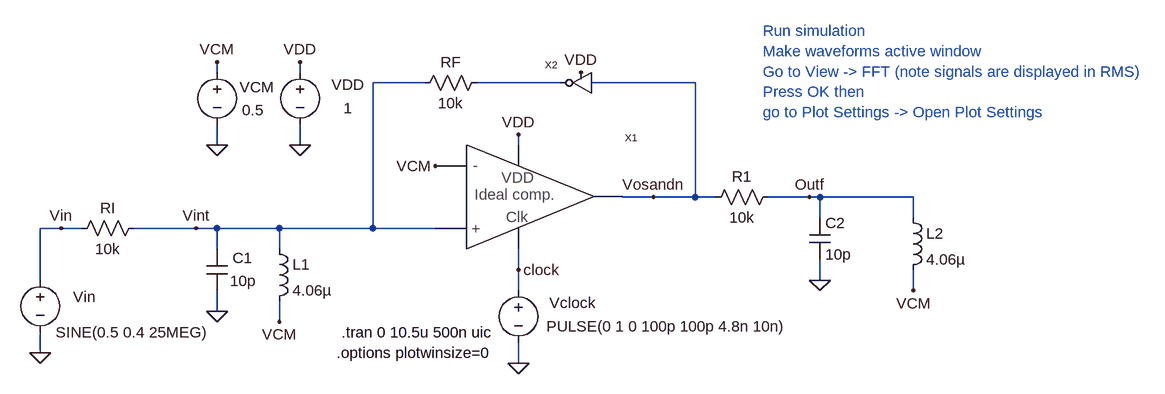
[diagram p0: schematic _Fig8_5_MSD.asc]
_Fig8_5_MSD.asc, the LTspice schematic file:
Version 4
SHEET 1 1132 680
WIRE -368 -80 -368 -96
WIRE -240 -80 -240 -96
WIRE -48 -64 -128 -64
WIRE 160 -64 32 -64
WIRE 368 -64 208 -64
WIRE -368 32 -368 0
WIRE -240 32 -240 0
WIRE 96 32 96 16
WIRE 304 112 256 112
WIRE 368 112 368 -64
WIRE 368 112 304 112
WIRE 400 112 368 112
WIRE 544 112 480 112
WIRE 560 112 544 112
WIRE 704 112 560 112
WIRE 560 144 560 112
WIRE 704 144 704 112
WIRE -608 160 -640 160
WIRE -576 160 -608 160
WIRE -400 160 -496 160
WIRE -368 160 -400 160
WIRE -272 160 -368 160
WIRE -128 160 -128 -64
WIRE -128 160 -272 160
WIRE -32 160 -128 160
WIRE -368 192 -368 160
WIRE -272 192 -272 160
WIRE 96 224 96 192
WIRE -640 240 -640 160
WIRE 560 240 560 208
WIRE 96 256 96 224
WIRE 704 256 704 224
WIRE -368 288 -368 256
WIRE -272 304 -272 272
WIRE -640 352 -640 320
WIRE 96 368 96 336
FLAG -240 32 0
FLAG 96 16 VDD
FLAG -240 -96 VDD
FLAG 96 368 0
FLAG 96 224 clock
FLAG -368 32 0
FLAG -368 -96 VCM
FLAG 304 112 Vosandn
FLAG -368 288 0
FLAG -640 352 0
FLAG -608 160 Vin
FLAG -400 160 Vint
FLAG 560 240 0
FLAG 544 112 Outf
FLAG -32 64 VCM
FLAG 192 -80 VDD
FLAG -272 304 VCM
FLAG 704 256 VCM
SYMBOL Ideal_clocked_comparator 16 112 R0
SYMATTR InstName X1
SYMBOL voltage -240 -96 R0
WINDOW 0 48 35 Left 0
WINDOW 3 67 71 Left 0
SYMATTR InstName VDD
SYMATTR Value 1
SYMBOL voltage 96 240 R0
WINDOW 0 48 35 Left 0
WINDOW 3 43 71 Left 0
WINDOW 123 0 0 Left 0
WINDOW 39 0 0 Left 0
SYMATTR InstName Vclock
SYMATTR Value PULSE(0 1 0 100p 100p 4.8n 10n)
SYMBOL voltage -368 -96 R0
WINDOW 0 35 39 Left 0
WINDOW 3 39 74 Left 0
SYMATTR InstName VCM
SYMATTR Value 0.5
SYMBOL cap -384 192 R0
WINDOW 0 40 14 Left 0
WINDOW 3 36 49 Left 0
SYMATTR InstName C1
SYMATTR Value 10p
SYMBOL res -480 144 R90
WINDOW 0 0 56 VBottom 0
WINDOW 3 32 56 VTop 0
SYMATTR InstName RI
SYMATTR Value 10k
SYMBOL res 48 -80 R90
WINDOW 0 0 56 VBottom 0
WINDOW 3 32 56 VTop 0
SYMATTR InstName RF
SYMATTR Value 10k
SYMBOL voltage -640 224 R0
WINDOW 0 51 42 Left 0
WINDOW 123 0 0 Left 0
WINDOW 39 0 0 Left 0
SYMATTR InstName Vin
SYMATTR Value SINE(0.5 0.4 25MEG)
SYMBOL res 496 96 R90
WINDOW 0 0 56 VBottom 0
WINDOW 3 32 56 VTop 0
SYMATTR InstName R1
SYMATTR Value 10k
SYMBOL cap 544 144 R0
SYMATTR InstName C2
SYMATTR Value 10p
SYMBOL inverter 208 -64 M0
SYMATTR InstName X2
SYMBOL ind -288 176 R0
SYMATTR InstName L1
SYMATTR Value 4.06µ
SYMBOL ind 688 128 R0
SYMATTR InstName L2
SYMATTR Value 4.06µ
TEXT -176 320 Left 0 !.tran 0 10.5u 500n uic
TEXT -184 352 Left 0 !.options plotwinsize=0
TEXT 472 -144 Left 0 ;Run simulation\nMake waveforms active window\nGo to View -> FFT (note signals are displayed in RMS)\nPress OK then \ngo to Plot Settings -> Open Plot Settings

The netlist it stands for:
* _Fig8_5_MSD.asc
XX1 VCM Vint Vosandn VDD clock Ideal_clocked_comparator  ; pins Vinm Vinp Vout VDD Clock
VDD VDD 0 1
Vclock clock 0 PULSE(0 1 0 100p 100p 4.8n 10n)
VCM VCM 0 0.5
C1 Vint 0 10p
RI Vint Vin 10k
RF N001 Vint 10k
Vin Vin 0 SINE(0.5 0.4 25MEG)
R1 Outf Vosandn 10k
C2 Outf 0 10p
XX2 Vosandn N001 VDD inverter  ; pins In Out VDD
L1 Vint VCM 4.06µ
L2 Outf VCM 4.06µ
.tran 0 10.5u 500n uic
.options plotwinsize=0
* Run simulation
* Make waveforms active window
* Go to View -> FFT (note signals are displayed in RMS)
* Press OK then
* go to Plot Settings -> Open Plot Settings
.backanno
.end